# Altium project delpf.PrjPcb
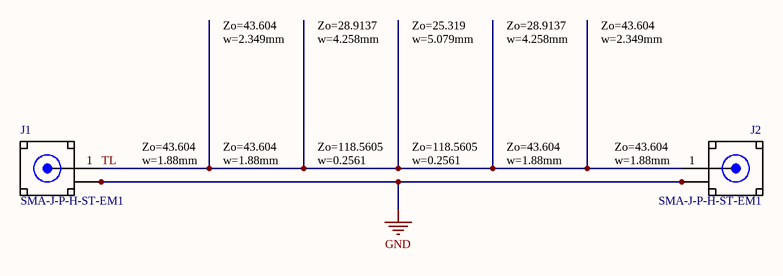
[diagram p0: tl.SchDoc]
1 sheet, 2 parts. Net scope: global (net labels, ports and power ports of the same name join across sheets).
Board file: tl.PcbDoc

## Sheet tl.SchDoc
size B

### Parts
J1  SMA-J-P-H-ST-EM1  [SMA-J-P-H-ST-EM1_SMA-J-P-H-ST-EM1(Primary)]
J2  SMA-J-P-H-ST-EM1  [SMA-J-P-H-ST-EM1_SMA-J-P-H-ST-EM1(Primary)]

### Nets
GND: J1.2_1(GND) J1.2_2(GND) J1.3_1(GND) J1.3_2(GND) J2.2_1(GND) J2.2_2(GND) J2.3_1(GND) J2.3_2(GND)
TL: J1.1(SIGNAL) J2.1(SIGNAL)

### Notes on the sheet
- Zo=43.604
- w=2.349mm
- Zo=28.9137
- w=4.258mm
- Zo=25.319
- w=5.079mm
- w=1.88mm
- w=0.2561
- Zo=118.5605
- (near J2) Zo=43.604
- (near J2) w=1.88mm

### Library data of the parts
J1 J2 = SMA-J-P-H-ST-EM1: SMA Connector Jack, Female Socket 50Ohm Board Edge, End Launch Solder; MF: Samtec; MP: SMA-J-P-H-ST-EM1; SnapEDA_Link: https://www.snapeda.com/parts/SMA-J-P-H-ST-EM1/Samtec%20Inc./view-part/134500/?ref=snap; Price: None; Package: None; Availability: Unavailable; Value: *